# EAGLE schematic PCB (EAGLE 9.3.0)
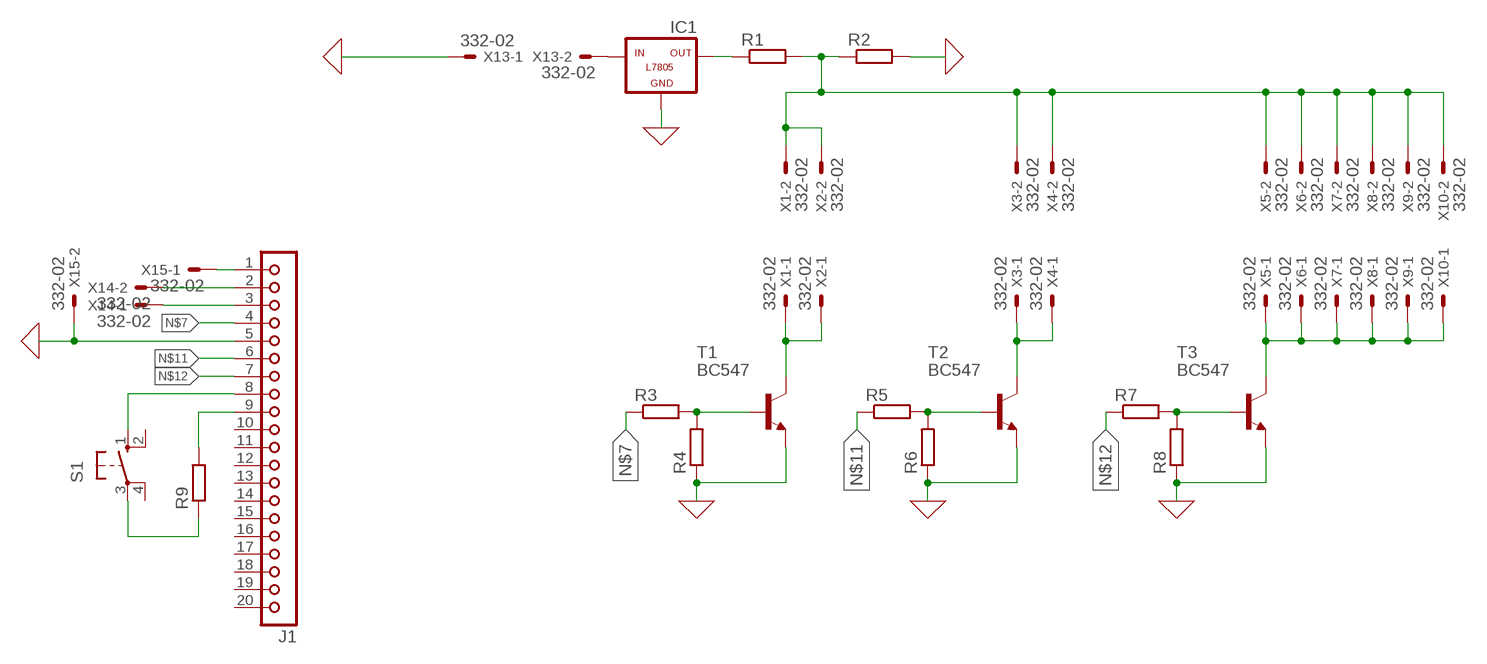
[diagram p0: schematic, sheet 1]

## Parts
IC1  L7805  [78XXL]
J1  JBK20L  [JBK20L]
R1  R-EU_0309/12  [0309/12]
R2  R-EU_0309/12  [0309/12]
R3  R-EU_0309/12  [0309/12]
R4  R-EU_0309/12  [0309/12]
R5  R-EU_0309/12  [0309/12]
R6  R-EU_0309/12  [0309/12]
R7  R-EU_0309/12  [0309/12]
R8  R-EU_0309/12  [0309/12]
R9  R-EU_0309/12  [0309/12]
S1  10-XX  [B3F-10XX]
T1  BC547  [TO92]
T2  BC547  [TO92]
T3  BC547  [TO92]
X1  332-02  [332-02]
X2  332-02  [332-02]
X3  332-02  [332-02]
X4  332-02  [332-02]
X5  332-02  [332-02]
X6  332-02  [332-02]
X7  332-02  [332-02]
X8  332-02  [332-02]
X9  332-02  [332-02]
X10  332-02  [332-02]
X13  332-02  [332-02]
X14  332-02  [332-02]
X15  332-02  [332-02]

## Nets
0: IC1.GND J1.5 R2.2 R4.1 R6.1 R8.1 T1.1(E) T2.1(E) T3.1(E) X13.1 X15.2 ; supply symbol labelled GND
N$1: IC1.OUT R1.1
N$2: J1.9 R9.2
N$3: R3.2 R4.2 T1.2(B)
N$4: T1.3(C) X1.1 X2.1
N$5: R5.2 R6.2 T2.2(B)
N$6: R7.2 R8.2 T3.2(B)
N$7: J1.4 R3.1
N$8: T2.3(C) X3.1 X4.1
N$9: T3.3(C) X5.1 X6.1 X7.1 X8.1 X9.1 X10.1
N$10: IC1.IN X13.2
N$11: J1.6 R5.1
N$12: J1.7 R7.1
N$14: R9.1 S1.3(P)
N$15: J1.8 S1.1(S)
N$16: J1.1 X15.1
N$18: J1.3 X14.1
N$19: J1.2 X14.2
N$20: R1.2 R2.1 X1.2 X2.2 X3.2 X4.2 X5.2 X6.2 X7.2 X8.2 X9.2 X10.2
Unconnected: J1.10 J1.11 J1.12 J1.13 J1.14 J1.15 J1.16 J1.17 J1.18 J1.19 J1.20 S1.2(S1) S1.4(P1)

## Library data of the parts
IC1 = tango:L7805: VOLTAGE REGULATOR
J1 = con-lsta:JBK20L: PIN HEADER; OC_FARNELL: unknown; OC_NEWARK: unknown
R1-R9 = rcl:R-EU_: RESISTOR, European symbol; SPICEPREFIX: R
S1 = switch-omron:10-XX: OMRON SWITCH; MPN: B3F-1000; OC_FARNELL: 176432; OC_NEWARK: 36M3542
T1-T3 = transistor:BC547: NPN TRANSISTOR
X1-X10 X13-X15 = con-garry:332-02: 2 Pin - 2mm Dual Row Source: www.mpe-connector.de / garry_shortform_2012.pdf

## Net classes
0 default: width 0.635 mm, drill 0.254 mm, clearance 0.635 mm